# EAGLE schematic HubsanTXModule (EAGLE 6.5.0)
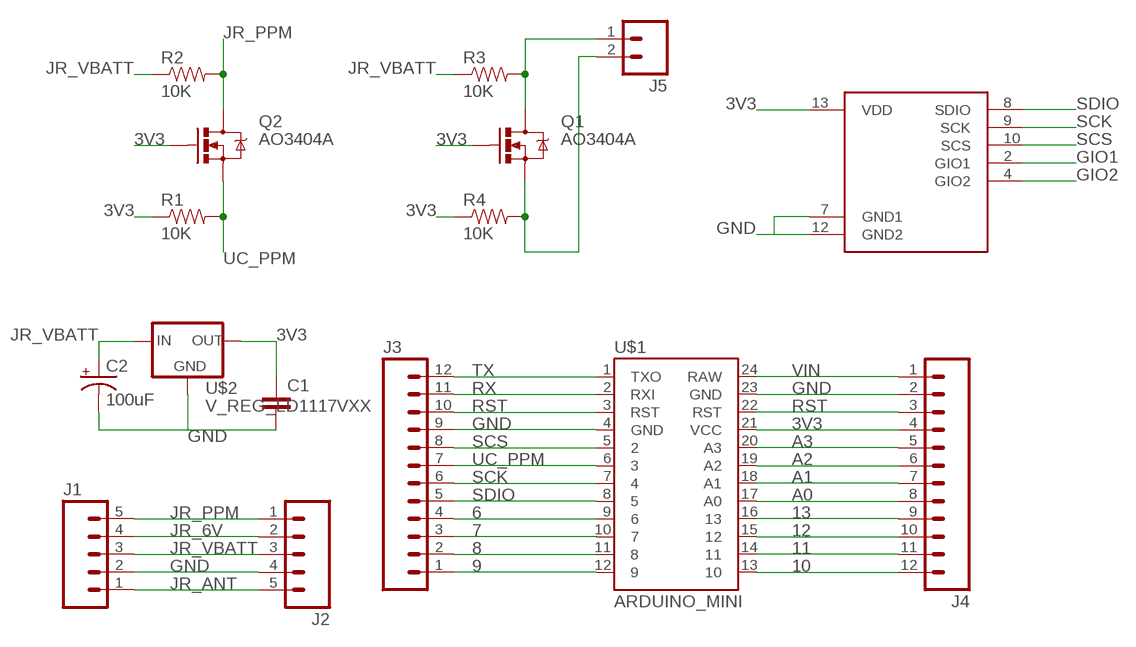
[diagram p0: schematic, sheet 1]

## Parts
C1  10UF10V10%(0805)  [0805-CAP]
C2  100uF  100UF-63V-20%(ELECT)  [NIC_10X10.5_CAP]
J1  M05PTH  [1X05]
J2  M05PTH  [1X05]
J3  M12PTH  [1X12]
J4  M12PTH  [1X12]
J5  M02PTH  [1X02]
Q1  AO3404A  MOSFET-NCHANNELAO3404A  [SOT23-3]
Q2  AO3404A  MOSFET-NCHANNELAO3404A  [SOT23-3]
R1  10K  10KOHM-1/10W-1%(0603)0603  [0603-RES]
R2  10K  10KOHM-1/10W-1%(0603)0603  [0603-RES]
R3  10K  10KOHM-1/10W-1%(0603)0603  [0603-RES]
R4  10K  10KOHM-1/10W-1%(0603)0603  [0603-RES]
U$1  ARDUINO_MINI  [ARDUINO_MINI]
U$2  V_REG_LD1117VXX  [78XXL]
U$3  A7105_DEVBOARD  [A7105_DEV1]

## Nets
3V3: C1.1 J4.4 Q1.1(G) Q2.1(G) R1.1 R4.1 U$1.21(VCC) U$2.GND(OUT) U$3.13(VDD)
6: J3.4 U$1.9
7: J3.3 U$1.10
8: J3.2 U$1.11
9: J3.1 U$1.12
10: J4.12 U$1.13
11: J4.11 U$1.14
12: J4.10 U$1.15
13: J4.9 U$1.16
A0: J4.8 U$1.17(A0)
A1: J4.7 U$1.18(A1)
A2: J4.6 U$1.19(A2)
A3: J4.5 U$1.20(A3)
GIO1: U$3.2(GIO1)
GIO2: U$3.4(GIO2)
GND: C1.2 C2.- J1.2 J2.4 J3.9 J4.2 U$1.4(GND) U$1.23(GND) U$2.IN(GND) U$3.7(GND1) U$3.12(GND2)
JR_6V: J1.4 J2.2
JR_ANT: J1.1 J2.5
JR_PPM: J1.5 J2.1 Q2.3(D) R2.2
JR_VBATT: C2.+ J1.3 J2.3 R2.1 R3.1 U$2.OUT(IN)
N$6: J5.2 Q1.2(S) R4.2
N$7: J5.1 Q1.3(D) R3.2
RST: J3.10 J4.3 U$1.3(RST) U$1.22(RST)
RX: J3.11 U$1.2(RXI)
SCK: J3.6 U$1.7 U$3.9(SCK)
SCS: J3.8 U$1.5 U$3.10(SCS)
SDIO: J3.5 U$1.8 U$3.8(SDIO)
TX: J3.12 U$1.1(TXO)
UC_PPM: J3.7 Q2.2(S) R1.2 U$1.6
VIN: J4.1 U$1.24(RAW)

## Library data of the parts
C1 = SparkFun-Capacitors:10UF10V10%(0805): CAP-11330; PROD_ID: CAP-11330
C2 = SparkFun-Capacitors:100UF-63V-20%(ELECT): CAP-08362 100uF electrolytic SMT 63V 20%; PROD_ID: CAP-08362
J1 J2 = SparkFun-Connectors:M05: Header 5 Standard 5-pin 0.1" header. Use with straight break away headers (SKU : PRT-00116), right angle break away headers (PRT-00553), swiss pins (PRT-00743), machine pins (PRT-00117), and female headers (PRT-00115). Molex polarized connector foot print use with SKU : PRT-08230 with associated crimp pins and housings.
J3 J4 = SparkFun-Connectors:M12: Header 12 Standard 12-pin 0.1" header. Use with straight break away headers (SKU : PRT-00116), right angle break away headers (PRT-00553), swiss pins (PRT-00743), machine pins (PRT-00117), and female headers (PRT-00115).
J5 = SparkFun-Connectors:M02: Standard 2-pin 0.1" header. Use with - straight break away headers ( PRT-00116) - right angle break away headers (PRT-00553) - swiss pins (PRT-00743) - machine pins (PRT-00117) - female headers (PRT-00115) Molex polarized connector foot print use with: PRT-08233 with associated crimp pins and housings. 2.54_SCREWTERM for use with PRT-10571. 3.5mm Screw Terminal footprints for PRT-08084 5mm Screw Terminal footprints for use with PRT-08432
Q1 Q2 = SparkFun-DiscreteSemi:MOSFET-NCHANNEL: Common NMOSFET Parts MFG P/N Store ID Prod ID FDD8780 TRANS-09984 SI7820DN TRANS-11055 FDS6630A IC-08089 2N7002PW TRANS-11151 FQP30N06L COM-10213 TRANS-10060 BSS123LT1G TRANS-08345 BSS138 TRANS-00830 BS170 2N7000; PROD_ID: TRAN-12988
R1-R4 = SparkFun-Resistors:10KOHM-1/10W-1%(0603): RES-00824; PROD_ID: RES-00824
U$1 = SparkFun-Boards:ARDUINO_MINI: Arduino Pro Mini footprint
U$2 = SparkFun-PowerIC:V_REG_LD1117VXX: LD1117VXX voltage regulator. We carry the 3.3V version (COM-00526) in TO-220 package.
U$3 = rf:A7105_DEVBOARD